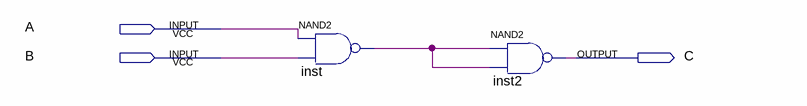
[diagram p0: schematic sheet]
// Quartus schematic Block10.bdf as structural Verilog: 2 symbols, 3 pins
module Block10 (
  input  A,
  input  B,
  output C
);

  wire inst_out;

  nand inst (inst_out, A, B);
  nand inst2 (C, inst_out, inst_out);
endmodule
